# Altium schematic sheet valve driver.SchDoc
size 297 x 209 mm; CompanyName: Sainsbury Wellcome Centre; Organization: FabLab; Address1: Sainsbury Wellcome Centre; Address2: 25 Howland Street; Address3: London; Address4: W1T 4JG; DocumentNumber: 1; SheetNumber: 1; SheetTotal: 1; swcgroup: FabLab; Org: Sainsbury Wellcome Centre; Add1: 25 Howland Street; Add2: London; Add3: W1T 4JG; WebAddress: www.sainsburywellcome.org; SheetSize: A4; SheetName: valve driver
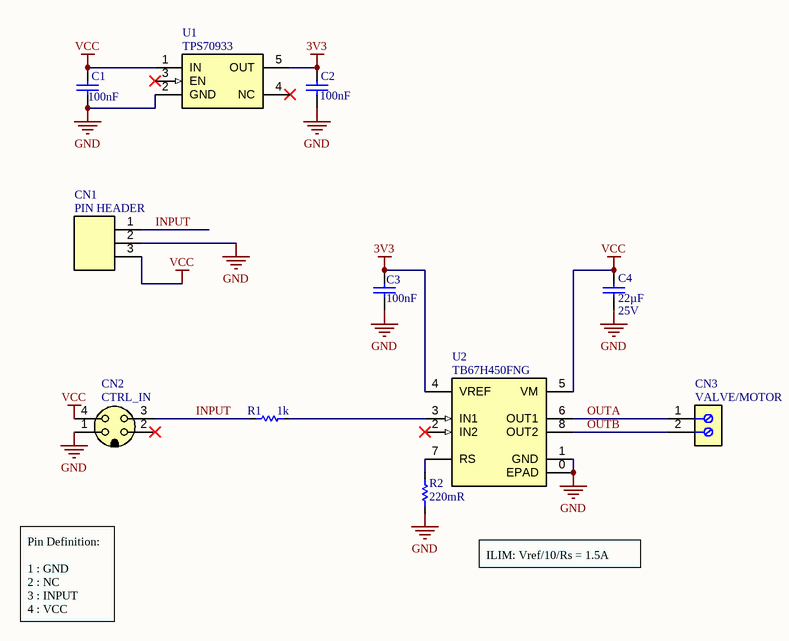
[diagram p0: valve driver.SchDoc]

## Parts
C1  value 100nF  [CAP_CHIP_0603]  (hidden comment: C0603-100nF-50V)
C2  value 100nF  [CAP_CHIP_0603]  (hidden comment: C0603-100nF-50V)
C3  value 100nF  [CAP_CHIP_0603]  (hidden comment: C0603-100nF-50V)
C4  value 22µF  Voltage Rating: 25V  [CAP_CHIP_0805]  (hidden comment: C0805-22uF-25V)
CN1  PIN HEADER  [PIN_2.54_90_1X3P]
CN2  CTRL_IN  [853-004-213R00Y]
CN3  VALVE/MOTOR  [TH-5.00-1X2P]
R1  value 1k  [RES_CHIP_0603]  (hidden comment: R0603-1K)
R2  value 220mR  [RES_CHIP_0805]  (hidden comment: R0805-0R22)
U1  TPS70933  [SOT23-5]
U2  TB67H450FNG  [SOIC8_EP_TI]

## Nets
3V3: C2.2 C3.2 U1.5(OUT) U2.4(VREF)
GND: C1.1 C2.1 C3.1 C4.1 CN1.2 CN2.1 R2.1 U1.2(GND) U2.0(EPAD) U2.1(GND)
VCC: C1.2 C4.2 CN1.3 CN2.4 U1.1(IN) U2.5(VM)
INPUT: CN1.1 CN2.3 R1.1
OUTA: CN3.1 U2.6(OUT1)
OUTB: CN3.2 U2.8(OUT2)
NetR1_2: R1.2 U2.3(IN1)
NetR2_2: R2.2 U2.7(RS)

Not connected (* = marked no-connect by the designer): CN2 2*; U1 3(EN)* 4(NC)*; U2 2(IN2)*

## Notes on the sheet
- ILIM: Vref/10/Rs = 1.5A
- Pin Definition:
  1 : GND
  2 : NC
  3 : INPUT
  4 : VCC
- FILE
- VARIANT
- DATE
- REVISION
- SHEET
- /
- PROJECT
- SIZE

## Library data of the parts
C1-C3 = CMP-611-0027-24: 0603 Multilayer Ceramic Capacitors MLCC; PartNumber: CC0603KRX7R9BB104; Tolerance: 10%; Pick&PlaceFootprint: C0603; Dielectric: X7R; Voltage Rating: 50V; Capacitor Type: Ceramic; RoHS: Yes; Mount: SMD; LCSC Part N.: C14663; Case/Package: 0603
C4 = CMP-611-0000-9: 0805 Multilayer Ceramic Capacitors MLCC; PartNumber: CL21A226MAQNNNE; Tolerance: 20%; Dielectric: X5R; Pick&PlaceFootprint: C0805; LCSC Part N.: C45783; Mount: SMD; RoHS: Yes; Capacitor Type: Ceramic; Case/Package: 0805
CN1 = CMP-00045-2: Through Hole,Right Angle,P=2.54mm; PartNumber: PZ254R-11-03P; Number of Positions: 3; Gender: Male; Pitch: 2.54mm; Mount: Through Hole; Number of Rows: 1; Orientation: Right Angle; LCSC Part N.: C492411; Number of Contacts: 3
CN2 = CMP-370-0028-8: CONN PLUG FMALE 4POS GOLD SOLDER; PartNumber: 853-004-213R001; Voltage Rating: 60V; Current Rating: 1A; Connector Type: Receptacle; Termination: Solder; Number of Pins: 4; LCSC Part N.: C21080541; Contact Plating: Gold; Fastening Type: Threaded
CN3 = CMP-00028-6: 1x2P 20A -40℃~+105℃ 250V Green 12~22 Direct Insert 5mm 2.5 1 2 Plugin,P=5mm Screw Terminal Blocks; PartNumber: WJ128V-5.0-2P; Gender: Male; Number of Positions: 2; Number of Rows: 1; LCSC Part N.: C8269; Pitch: 5mm; Mount: Thought Hole; Number of Contacts: 2; Orientation: Straight
R1 = CMP-633-0013-26: 100mW Thick Film Resistors 75V ±100ppm/℃ ±1% 0603 Chip Resistor; PartNumber: 0603WAF1001T5E; Pick&PlaceFootprint: R0603; Number of Resistors: 1; Voltage Rating: 75V; Case/Package: 0603; Tolerance: 1%; Mount: Surface Mount; LCSC Part N.: C21190; Power Rating: 100mW
R2 = CMP-633-0220-1: Res Thick Film 0805 0.22 Ohm 1% 0.5W(1/2W) 0ppm/C to 100ppm/C Pad SMD T/R Automotive AEC-Q200; PartNumber: ERJ-6DQFR22V; Number of Resistors: 1; Pick&PlaceFootprint: R0805; Power Rating: 500mW; Tolerance: 1%; LCSC Part N.: C6844934; Mount: SMD; Case/Package: 0805
U1 = CMP-970-0051-1: LDO Regulator Pos 3.3V 0.15A 5-Pin SOT-23 T/R; PartNumber: TPS70933DBVR; Quiescent Current: 1uA; Output Type: Fixed; Load Regulation: 0.6%; PSRR: 80dB; Line Regulation: 0.1%; Max Output Current: 150mA; Accuracy: 2%; Output Noise: 0.19mV; Dropout Voltage: 960mV; Max Input Voltage: 30V; LCSC Part N.: C89347; Output Voltage: 3.3V
U2 = CMP-970-0052-3: Brushed Motor Driver IC, 50V, 3.5A, SOP8 Package; Max Supply Voltage: 44V; Min Supply Voltage: 4.5V; PWM Freqency: 400kHz; Pick&PlaceFootprint: HSOP8; RDS(ON): 600mR; PartNumber: TB67H450FNG; LCSC Part N.: C545417; Max Output current: 3.5A